# Altium schematic sheet HackCube 2.SchDoc
size A4
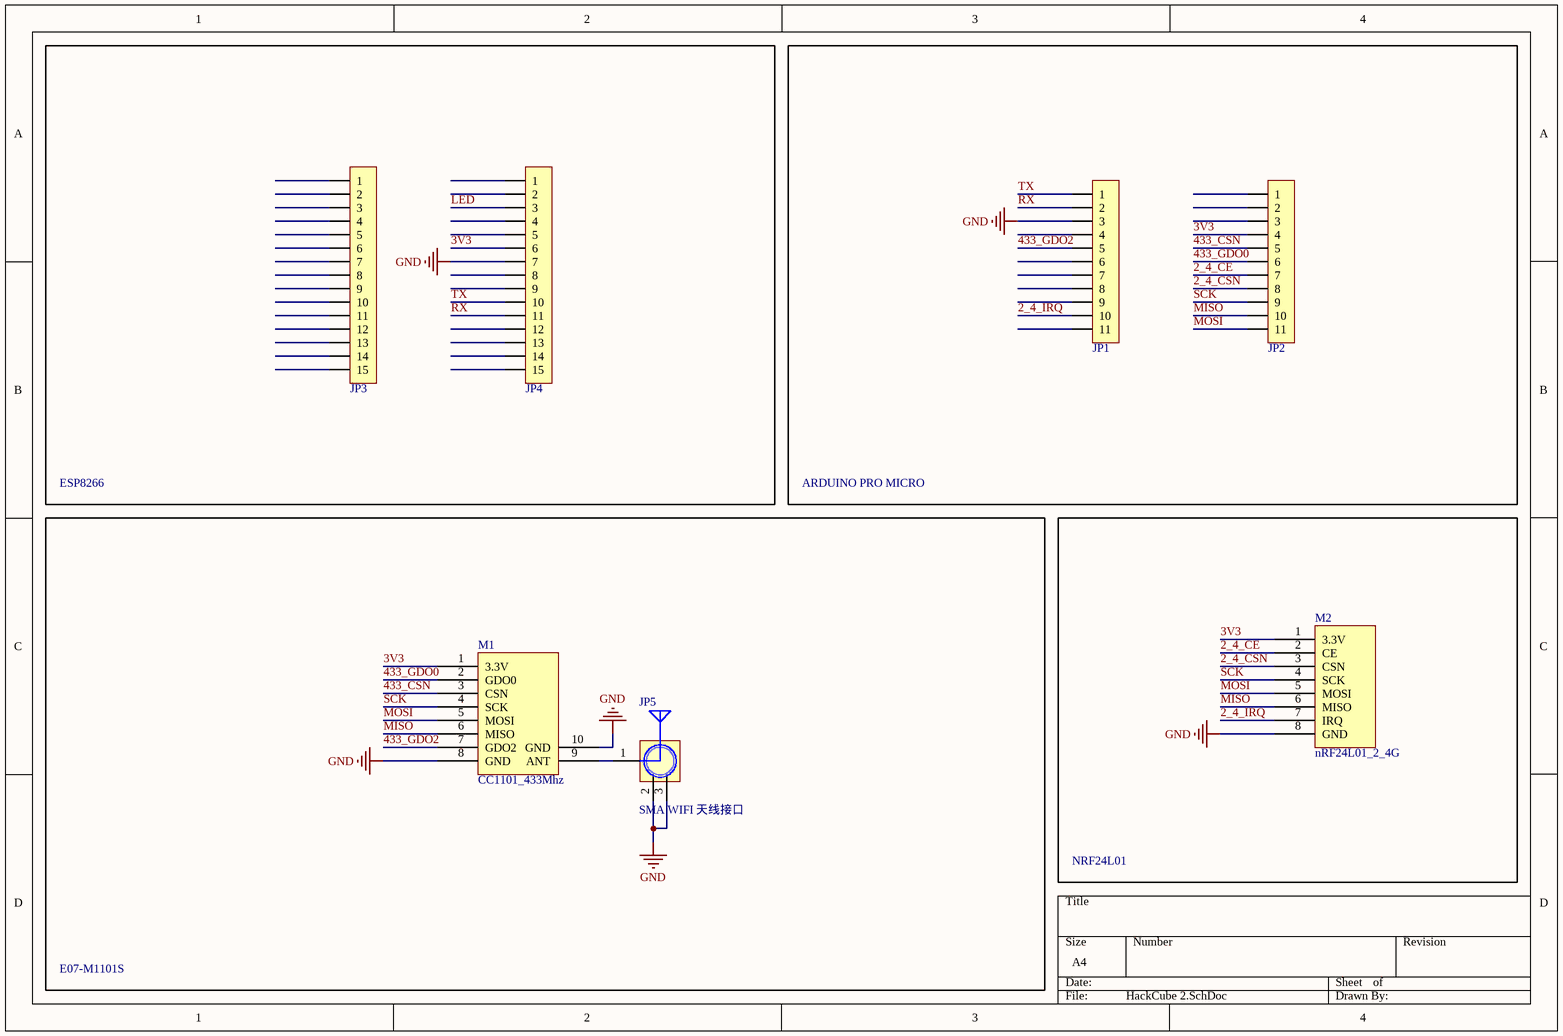
[diagram p0: HackCube 2.SchDoc]

## Parts
JP1  HDR-1X11  [HDR2.54-LI-11P]  (value not drawn)
JP2  HDR-1X11  [HDR2.54-LI-11P]  (value not drawn)
JP3  HDR-1X15  [HDR2.54-LI-15P]  (value not drawn)
JP4  HDR-1X15  [HDR2.54-LI-15P]  (value not drawn)
JP5  SMA WIFI 天线接口  [SMA-KE]
M1  CC1101_433Mhz  [PE07-M1101S]
M2  nRF24L01_2_4G  [PE01-ML01SP2]

## Blocks framed on the sheet
ESP8266: JP3 JP4
ARDUINO PRO MICRO: JP1 JP2
E07-M1101S: JP5 M1
NRF24L01: M2

## Nets
GND: JP1.3 JP4.7 JP5.2(GND) JP5.3(GND) M1.8(GND) M1.10(GND) M2.8(GND)
2_4_CE: JP2.7 M2.2(CE)
2_4_CSN: JP2.8 M2.3(CSN)
2_4_IRQ: JP1.10 M2.7(IRQ)
3V3: JP2.4 JP4.6 M1.1(3.3V) M2.1(3.3V)
433_CSN: JP2.5 M1.3(CSN)
433_GDO0: JP2.6 M1.2(GDO0)
433_GDO2: JP1.5 M1.7(GDO2)
LED: JP4.3
MISO: JP2.10 M1.6(MISO) M2.6(MISO)
MOSI: JP2.11 M1.5(MOSI) M2.5(MOSI)
RX: JP1.2 JP4.11
SCK: JP2.9 M1.4(SCK) M2.4(SCK)
TX: JP1.1 JP4.10
NetJP5_1: JP5.1(ANT) M1.9(ANT)

Not connected (* = marked no-connect by the designer): JP1 4 6 7 8 9 11; JP2 1 2 3; JP3 1 2 3 4 5 6 7 8 9 10 11 12 13 14 15; JP4 1 2 4 5 8 9 12 13 14 15

## Library data of the parts
JP1 JP2 = Header 11: 11P接插件; 版权归属: 源创客; BOM名称: 11P接插件; 学习资源: www.ooocke.com
JP3 JP4 = Header 15: 15P接插件; 版权归属: 源创客; BOM名称: 15P接插件; 学习资源: www.ooocke.com
JP5 = SMA: SMA-2.4G射频天线接口; 版权归属: 源创客; BOM名称: SMA-2.4G射频天线接口; 学习资源: www.ooocke.com